# EAGLE design 3x3_LED (EAGLE 7.5.0)
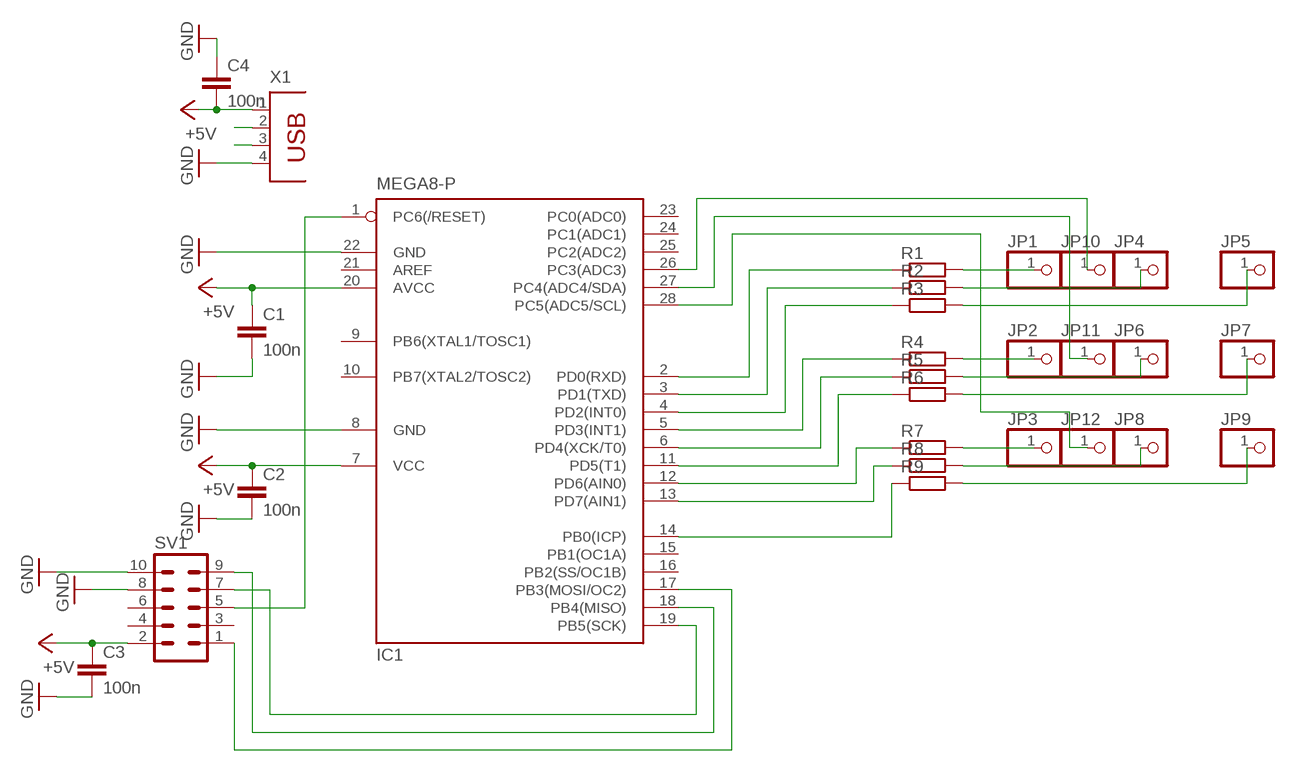
[diagram p0: schematic, sheet 1]

## Parts
C1  100n  C-EU025-024X044  [C025-024X044]
C2  100n  C-EU025-024X044  [C025-024X044]
C3  100n  C-EU025-024X044  [C025-024X044]
C4  100n  C-EU025-024X044  [C025-024X044]
IC1  MEGA8-P  [DIL28-3]
JP1  PINHD-1X1  [1X01]
JP2  PINHD-1X1  [1X01]
JP3  PINHD-1X1  [1X01]
JP4  PINHD-1X1  [1X01]
JP5  PINHD-1X1  [1X01]
JP6  PINHD-1X1  [1X01]
JP7  PINHD-1X1  [1X01]
JP8  PINHD-1X1  [1X01]
JP9  PINHD-1X1  [1X01]
JP10  PINHD-1X1  [1X01]
JP11  PINHD-1X1  [1X01]
JP12  PINHD-1X1  [1X01]
R1  R-EU_0207/12  [0207/12]
R2  R-EU_0207/12  [0207/12]
R3  R-EU_0207/12  [0207/12]
R4  R-EU_0207/12  [0207/12]
R5  R-EU_0207/12  [0207/12]
R6  R-EU_0207/12  [0207/12]
R7  R-EU_0207/12  [0207/12]
R8  R-EU_0207/12  [0207/12]
R9  R-EU_0207/12  [0207/12]
SV1  ML10  [ML10]
X1  PN61729  [PN61729]

## Nets
+5V: C1.1 C2.1 C3.1 C4.2 IC1.7(VCC) IC1.20(AVCC) SV1.2 X1.1
GND: C1.2 C2.2 C3.2 C4.1 IC1.8(GND) IC1.22(GND) SV1.8 SV1.10 X1.4
N$1: JP1.1 R1.2
N$2: JP4.1 R2.2
N$3: JP5.1 R3.2
N$4: JP2.1 R4.2
N$5: JP6.1 R5.2
N$6: JP7.1 R6.2
N$7: JP3.1 R7.2
N$8: JP8.1 R8.2
N$9: JP9.1 R9.2
N$10: IC1.2(PD0(RXD)) R1.1
N$11: IC1.3(PD1(TXD)) R2.1
N$12: IC1.4(PD2(INT0)) R3.1
N$13: IC1.5(PD3(INT1)) R4.1
N$14: IC1.6(PD4(XCK/T0)) R5.1
N$15: IC1.11(PD5(T1)) R6.1
N$16: IC1.12(PD6(AIN0)) R7.1
N$17: IC1.13(PD7(AIN1)) R8.1
N$18: IC1.14(PB0(ICP)) R9.1
N$19: IC1.26(PC3(ADC3)) JP10.1
N$20: IC1.27(PC4(ADC4/SDA)) JP11.1
N$21: IC1.28(PC5(ADC5/SCL)) JP12.1
N$24: IC1.17(PB3(MOSI/OC2)) SV1.1
N$25: X1.2
N$26: X1.3
N$27: IC1.19(PB5(SCK)) SV1.7
N$28: IC1.1(PC6(/RESET)) SV1.5
N$29: IC1.18(PB4(MISO)) SV1.9
Unconnected: IC1.9(PB6(XTAL1/TOSC1)) IC1.10(PB7(XTAL2/TOSC2)) IC1.15(PB1(OC1A)) IC1.16(PB2(SS/OC1B)) IC1.21(AREF) IC1.23(PC0(ADC0)) IC1.24(PC1(ADC1)) IC1.25(PC2(ADC2)) SV1.3 SV1.4 SV1.6

## Library data of the parts
C1-C4 = rcl:C-EU: CAPACITOR, European symbol
IC1 = atmel:MEGA8-P: MICROCONTROLLER 8 Kbytes FLASH, 1 kbytes SRAM, 512 bytes EEPROM, USART, 4-channel 10 bit ADC, 2-channel 8 bit ADC Pin compatible with Atmega48, ATMega88, ATMega168 Source: avr.lbr; OC_FARNELL: unknown; OC_NEWARK: unknown
JP1-JP12 = pinhead:PINHD-1X1: PIN HEADER
R1-R9 = rcl:R-EU_: RESISTOR, European symbol
SV1 = con-harting-ml:ML10: HARTING; OC_FARNELL: unknown; OC_NEWARK: unknown
X1 = con-berg:PN61729: BERG USB connector; OC_FARNELL: unknown; OC_NEWARK: unknown

## Board
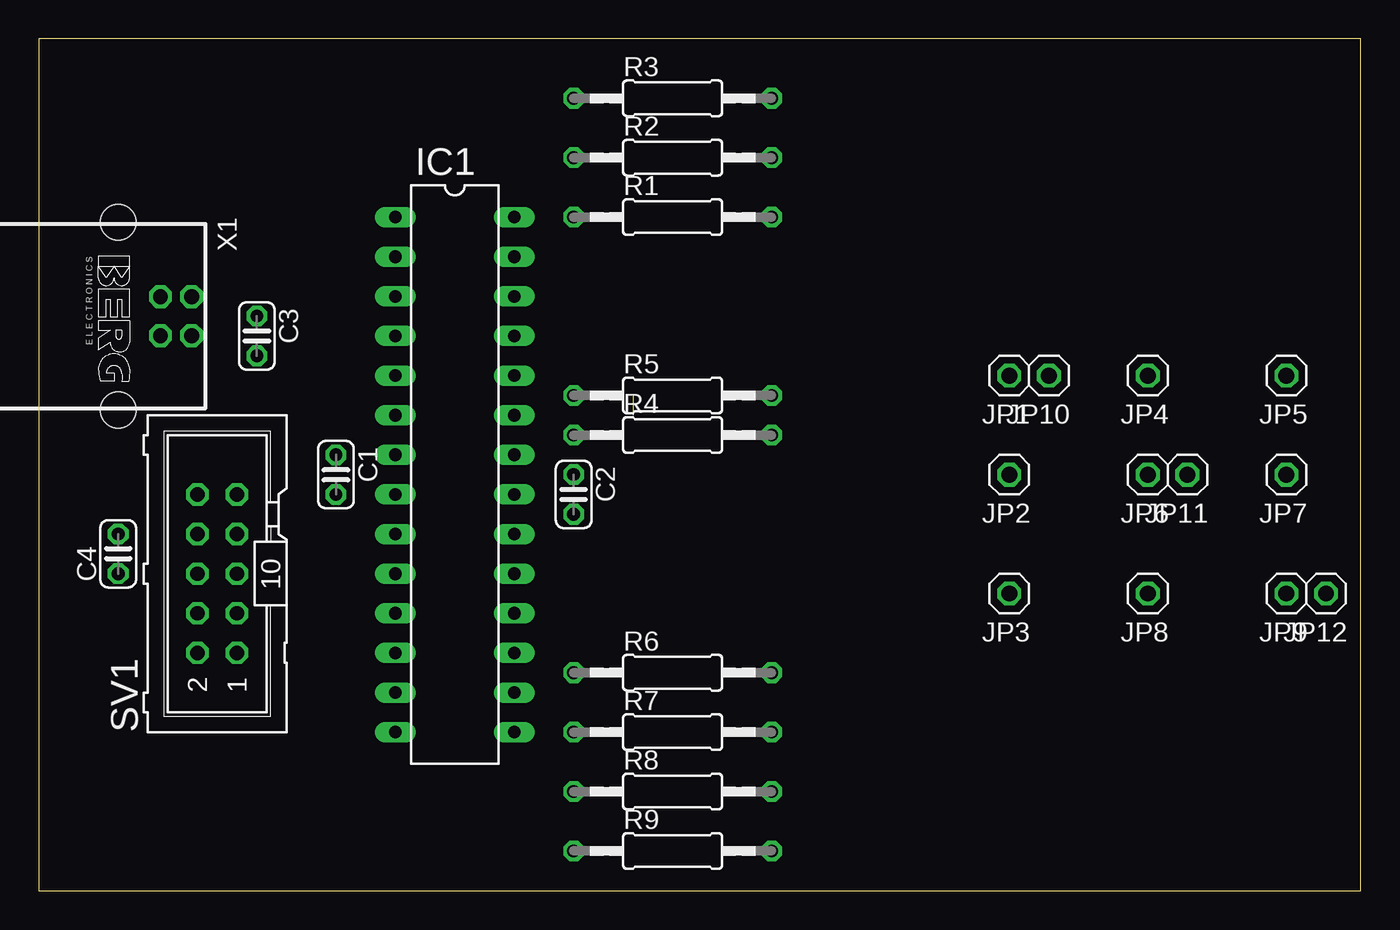
[diagram p1: board, top side]
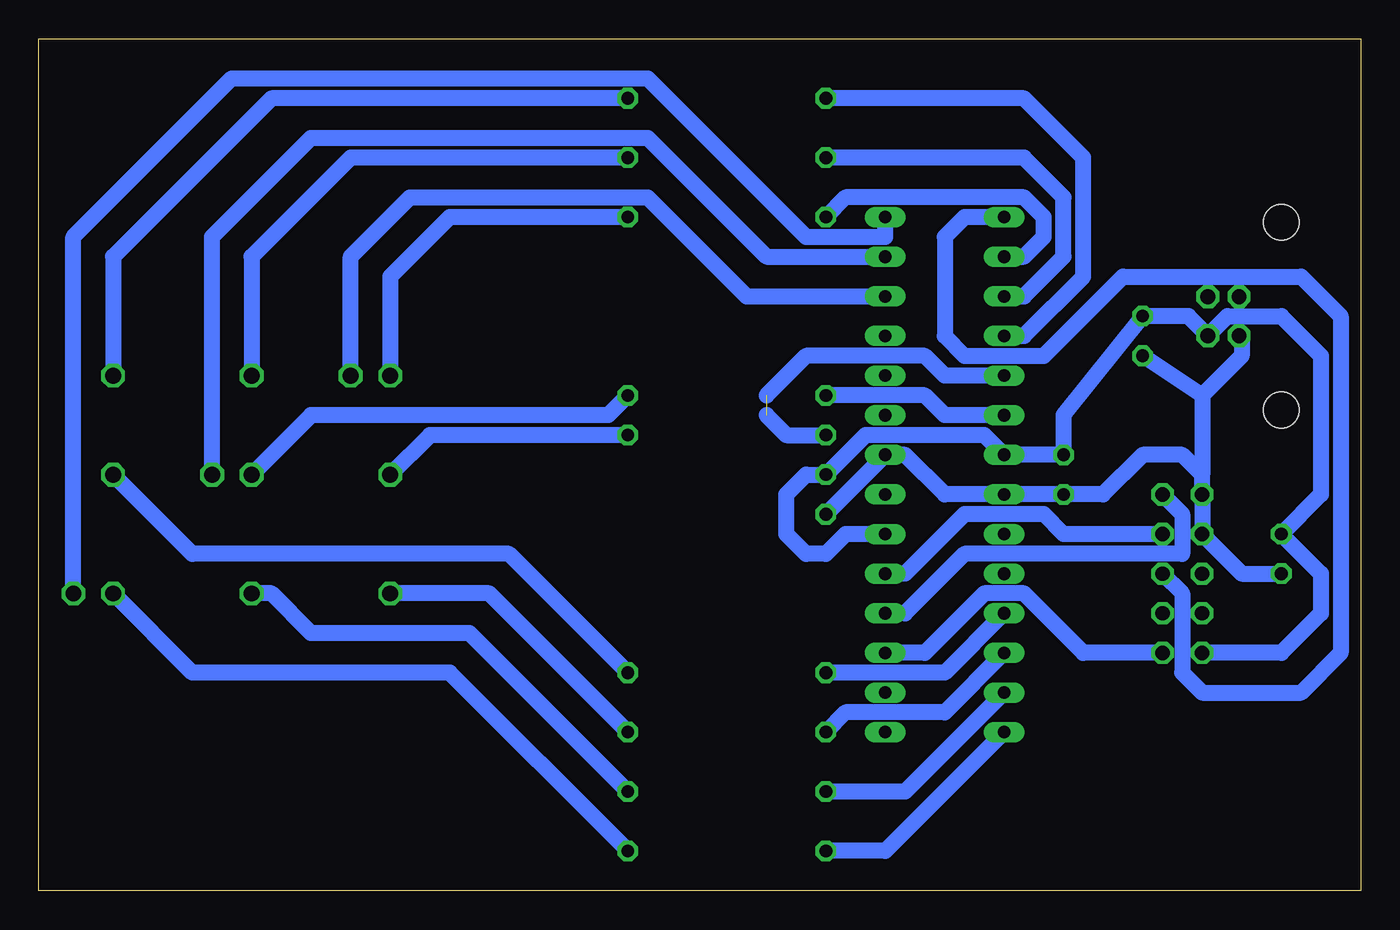
[diagram p2: board, bottom side, seen from below]

Size 84.76 x 54.6 mm. Coordinates in mm from the lower left corner, seen from the top.
Outline: 0,0 84.76,0 84.76,54.6 0,54.6 0,0
Copper layers (1*16): Top 0.035mm / dielectric 1.5mm / Bottom 0.035mm
Design rules "default": minimum track width 10mil, minimum drill 24mil, track to track 8mil, track to pad 8mil, pad to pad 8mil, via to via 8mil, smd to smd 8mil, copper to edge 40mil, drill to drill 8mil, minimum pad ring 10mil, minimum via ring 8mil, stop-mask expansion 4mil, vias tented up to drill 0mil, thermal gap 10mil

### Footprints (pad centres in the part's own frame; a part is rotated, then mirrored left to right if it is on the bottom)
C025-024X044 = drill 0.813 octagon: 1 -1.27,0; 2 1.27,0
DIL28-3 = drill 0.813 long: 1 -16.51,-3.81; 2 -13.97,-3.81; 3 -11.43,-3.81; 4 -8.89,-3.81; 5 -6.35,-3.81; 6 -3.81,-3.81; 7 -1.27,-3.81; 8 1.27,-3.81; 9 3.81,-3.81; 10 6.35,-3.81; 11 8.89,-3.81; 12 11.43,-3.81; 13 13.97,-3.81; 14 16.51,-3.81; 15 16.51,3.81; 16 13.97,3.81; 17 11.43,3.81; 18 8.89,3.81; 19 6.35,3.81; 20 3.81,3.81; 21 1.27,3.81; 22 -1.27,3.81; 23 -3.81,3.81; 24 -6.35,3.81; 25 -8.89,3.81; 26 -11.43,3.81; 27 -13.97,3.81; 28 -16.51,3.81
1X01 = drill 1.016 octagon: 1 0,0
0207/12 = drill 0.813 octagon: 1 -6.35,0; 2 6.35,0
ML10 = drill 0.914 octagon: 1 -5.08,-1.27; 2 -5.08,1.27; 3 -2.54,-1.27; 4 -2.54,1.27; 5 0,-1.27; 6 0,1.27; 7 2.54,-1.27; 8 2.54,1.27; 9 5.08,-1.27; 10 5.08,1.27
PN61729 = drill 0.95 octagon: 1 1.25,4.71; 2 -1.25,4.71; 3 -1.25,2.71; 4 1.25,2.71 | hole 2.3: -6.02,0; 6.02,0

### Placement (x,y rotation side)
C1  19.05,26.67 270 top
C2  34.29,25.4 270 top
C3  13.97,35.56 270 top
C4  5.08,21.59 90 top
IC1  26.67,26.67 270 top
JP1  62.23,33.02 180 top
JP2  62.23,26.67 180 top
JP3  62.23,19.05 180 top
JP4  71.12,33.02 180 top
JP5  80.01,33.02 180 top
JP6  71.12,26.67 180 top
JP7  80.01,26.67 180 top
JP8  71.12,19.05 180 top
JP9  80.01,19.05 180 top
JP10  64.77,33.02 180 top
JP11  73.66,26.67 180 top
JP12  82.55,19.05 180 top
R1  40.64,43.18 0 top
R2  40.64,46.99 0 top
R3  40.64,50.8 0 top
R4  40.64,29.21 0 top
R5  40.64,31.75 0 top
R6  40.64,13.97 0 top
R7  40.64,10.16 0 top
R8  40.64,6.35 0 top
R9  40.64,2.54 0 top
SV1  11.43,20.32 90 top
X1  5.08,36.83 270 top

### Tracks (layer width: path | path; a pad name or v marks a point on that pad's centre or on a via)
+5V
  Bottom 1.016: SV1.2 5.08,15.24 2.54,17.78 2.54,20.32 C4.2 2.54,25.4 2.54,34.29 5.08,36.83 8.54,36.83 X1.1 11.04,36.83 C3.1 19.05,30.48 C1.1 IC1.7 24.13,29.21 31.75,29.21 C2.1 35.56,26.67 36.83,25.4 36.83,22.86 35.56,21.59 34.29,21.59 33.02,22.86 IC1.20
GND
  Bottom 1.016: C4.1 7.62,20.32 SV1.8 SV1.10 10.16,26.67 | C2.2 IC1.22 29.21,27.94 26.67,25.4 IC1.8 C1.2 16.51,25.4 13.97,27.94 11.43,27.94 10.16,26.67 | X1.4 7.62,35.41 7.62,34.29 10.16,31.75 | 10.16,31.75 10.16,26.67 | C3.2 10.16,31.75
N$1
  Bottom 1.016: R1.2 58.42,43.18 62.23,39.37 JP1.1
N$2
  Bottom 1.016: R2.2 64.77,46.99 71.12,40.64 JP4.1
N$3
  Bottom 1.016: R3.2 69.85,50.8 80.01,40.64 JP5.1
N$4
  Bottom 1.016: R4.2 59.69,29.21 JP2.1
N$5
  Bottom 1.016: JP6.1 67.31,30.48 48.26,30.48 R5.2
N$6
  Bottom 1.016: R6.2 54.61,21.59 74.93,21.59 JP7.1
N$7
  Bottom 1.016: R7.2 55.88,19.05 JP3.1
N$8
  Bottom 1.016: R8.2 57.15,16.51 67.31,16.51 69.85,19.05 JP8.1
N$9
  Bottom 1.016: R9.2 58.42,13.97 74.93,13.97 JP9.1
N$10
  Bottom 1.016: IC1.2 21.59,40.64 20.32,41.91 20.32,43.18 21.59,44.45 33.02,44.45 R1.1
N$11
  Bottom 1.016: IC1.3 21.59,38.1 19.05,40.64 19.05,44.45 21.59,46.99 R2.1
N$12
  Bottom 1.016: IC1.4 21.59,35.56 17.78,39.37 17.78,46.99 21.59,50.8 R3.1
N$13  (1 unrouted)
  Bottom 1.016: IC1.5 26.67,33.02 27.94,34.29 35.56,34.29 38.1,31.75 | 38.1,30.48 36.83,29.21 R4.1
N$14
  Bottom 1.016: IC1.6 26.67,30.48 27.94,31.75 R5.1
N$15
  Bottom 1.016: IC1.11 26.67,13.97 R6.1
N$16
  Bottom 1.016: IC1.12 26.67,11.43 33.02,11.43 R7.1
N$17
  Bottom 1.016: IC1.13 29.21,6.35 R8.1
N$18
  Bottom 1.016: IC1.14 30.48,2.54 R9.1
N$19
  Bottom 1.016: JP10.1 64.77,40.64 60.96,44.45 45.72,44.45 39.37,38.1 IC1.26
N$20
  Bottom 1.016: JP11.1 73.66,41.91 67.31,48.26 45.72,48.26 38.1,40.64 IC1.27
N$21
  Bottom 1.016: JP12.1 82.55,41.91 72.39,52.07 45.72,52.07 35.56,41.91 30.48,41.91 IC1.28
N$24
  Bottom 1.016: SV1.1 17.78,15.24 21.59,19.05 24.13,19.05 27.94,15.24 IC1.17
N$27
  Bottom 1.016: SV1.7 19.05,22.86 20.32,24.13 25.4,24.13 29.21,20.32 IC1.19
N$28
  Bottom 1.016: SV1.5 11.43,19.05 11.43,13.97 10.16,12.7 3.81,12.7 1.27,15.24 1.27,36.83 3.81,39.37 15.24,39.37 20.32,34.29 25.4,34.29 26.67,35.56 26.67,41.91 25.4,43.18 IC1.1
N$29
  Bottom 1.016: SV1.9 11.43,24.13 11.43,21.59 25.4,21.59 29.21,17.78 IC1.18